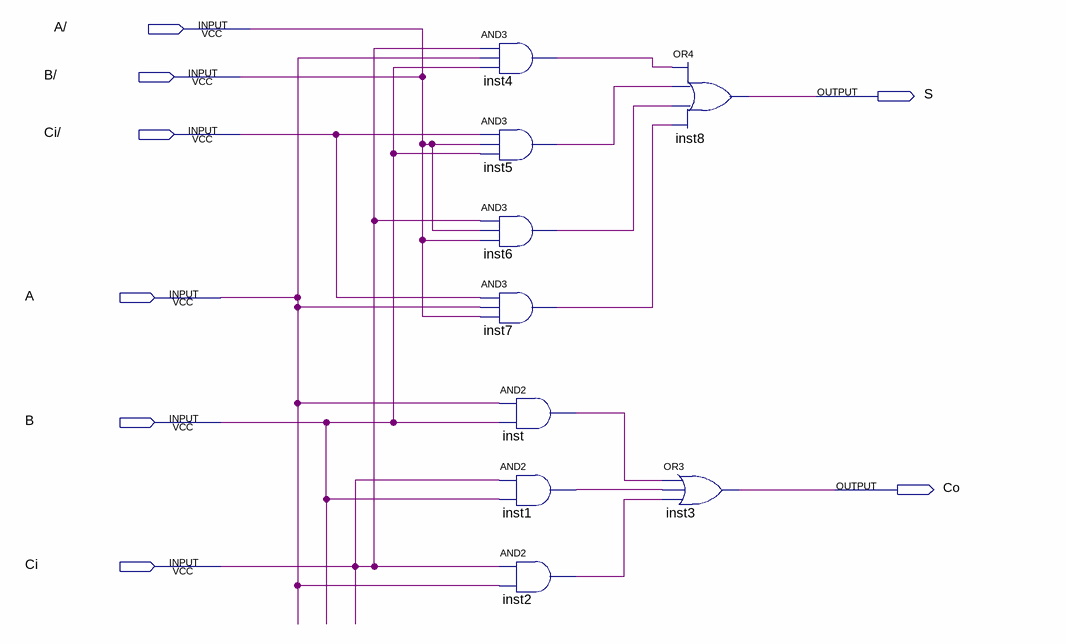
[diagram p0: schematic sheet]
// Quartus schematic fulladder_1b.bdf as structural Verilog: 9 symbols, 8 pins
module fulladder_1b (
  input  \A/ ,
  input  \B/ ,
  input  \Ci/ ,
  input  A,
  input  B,
  input  Ci,
  output S,
  output Co
);

  wire inst1_out, inst2_out, inst4_out, inst5_out, inst6_out, inst7_out, inst_out;

  and inst4 (inst4_out, Ci, A, B);
  and inst5 (inst5_out, \Ci/ , \A/ , B);
  and inst6 (inst6_out, Ci, \A/ , \A/ );
  and inst7 (inst7_out, \Ci/ , A, \A/ );
  and inst (inst_out, A, B);
  and inst1 (inst1_out, Ci, B);
  and inst2 (inst2_out, Ci, A);
  or inst8 (S, inst4_out, inst5_out, inst6_out, inst7_out);
  or inst3 (Co, inst_out, inst1_out, inst2_out);

  assign \B/  = \A/ ;
endmodule
